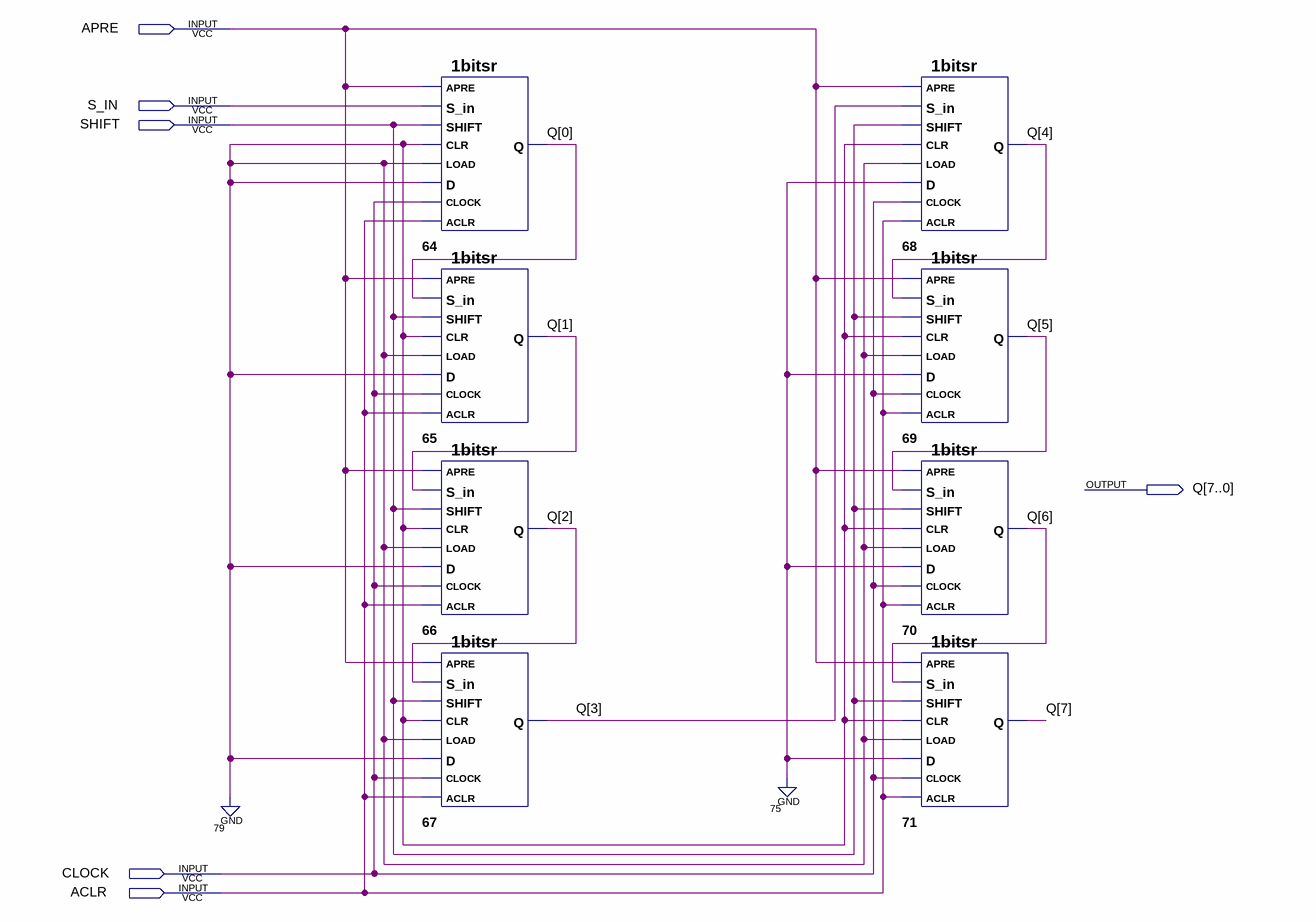
[diagram p0: schematic sheet]
// Quartus schematic 8bitsr.bdf as structural Verilog: 8 symbols, 6 pins
module \8bitsr  (
  input  APRE,
  input  S_IN,
  input  SHIFT,
  input  CLOCK,
  input  ACLR,
  output [7:0] Q
);

  \1bitsr  u_64 (
    .APRE(APRE), .S_in(S_IN), .SHIFT(SHIFT), .CLR(1'b0), .LOAD(1'b0), .D(1'b0), .CLOCK(CLOCK), .ACLR(ACLR),
    .Q(Q[0]));
  \1bitsr  u_65 (
    .APRE(APRE), .S_in(Q[0]), .SHIFT(SHIFT), .CLR(1'b0), .LOAD(1'b0), .D(1'b0), .CLOCK(CLOCK), .ACLR(ACLR),
    .Q(Q[1]));
  \1bitsr  u_66 (
    .APRE(APRE), .S_in(Q[1]), .SHIFT(SHIFT), .CLR(1'b0), .LOAD(1'b0), .D(1'b0), .CLOCK(CLOCK), .ACLR(ACLR),
    .Q(Q[2]));
  \1bitsr  u_67 (
    .APRE(APRE), .S_in(Q[2]), .SHIFT(SHIFT), .CLR(1'b0), .LOAD(1'b0), .D(1'b0), .CLOCK(CLOCK), .ACLR(ACLR),
    .Q(Q[3]));
  \1bitsr  u_68 (
    .APRE(APRE), .S_in(Q[3]), .SHIFT(SHIFT), .CLR(1'b0), .LOAD(1'b0), .D(1'b0), .CLOCK(CLOCK), .ACLR(ACLR),
    .Q(Q[4]));
  \1bitsr  u_69 (
    .APRE(APRE), .S_in(Q[4]), .SHIFT(SHIFT), .CLR(1'b0), .LOAD(1'b0), .D(1'b0), .CLOCK(CLOCK), .ACLR(ACLR),
    .Q(Q[5]));
  \1bitsr  u_70 (
    .APRE(APRE), .S_in(Q[5]), .SHIFT(SHIFT), .CLR(1'b0), .LOAD(1'b0), .D(1'b0), .CLOCK(CLOCK), .ACLR(ACLR),
    .Q(Q[6]));
  \1bitsr  u_71 (
    .APRE(APRE), .S_in(Q[6]), .SHIFT(SHIFT), .CLR(1'b0), .LOAD(1'b0), .D(1'b0), .CLOCK(CLOCK), .ACLR(ACLR),
    .Q(Q[7]));
endmodule
